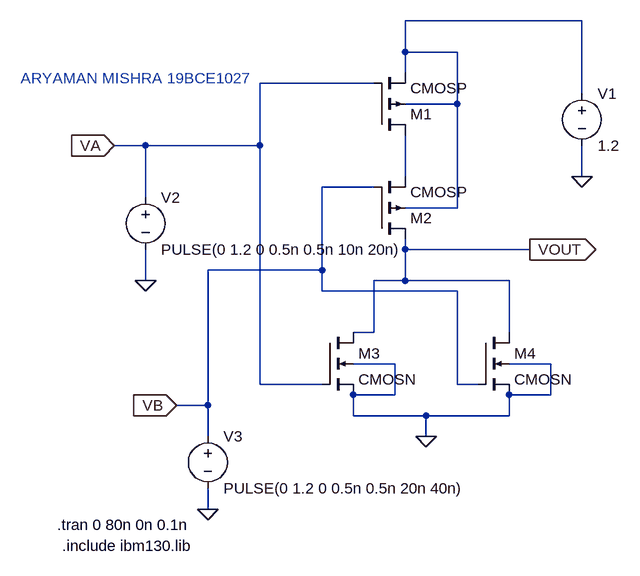
[diagram p0: schematic exp6_task6.asc]
exp6_task6.asc, the LTspice schematic file:
Version 4
SHEET 1 880 680
WIRE 544 -176 272 -176
WIRE 272 -128 272 -176
WIRE 352 -128 272 -128
WIRE 272 -96 272 -128
WIRE 224 -80 48 -80
WIRE 544 -64 544 -176
WIRE 352 -48 352 -128
WIRE 352 -48 272 -48
WIRE -128 16 -176 16
WIRE 48 16 48 -80
WIRE 48 16 -128 16
WIRE 272 64 272 0
WIRE 544 64 544 16
WIRE 224 80 144 80
WIRE -128 96 -128 16
WIRE 352 112 352 -48
WIRE 352 112 272 112
WIRE 272 176 272 160
WIRE 464 176 272 176
WIRE 144 208 144 80
WIRE 144 208 -32 208
WIRE -128 224 -128 176
WIRE 272 224 272 176
WIRE 272 224 224 224
WIRE 432 224 272 224
WIRE 144 240 144 208
WIRE 352 240 144 240
WIRE 224 304 224 224
WIRE 224 304 192 304
WIRE 432 304 432 224
WIRE 256 352 192 352
WIRE 496 352 432 352
WIRE 48 384 48 16
WIRE 144 384 48 384
WIRE 352 384 352 240
WIRE 384 384 352 384
WIRE 256 400 256 352
WIRE 256 400 192 400
WIRE 496 400 496 352
WIRE 496 400 432 400
WIRE -32 416 -32 208
WIRE -32 416 -80 416
WIRE 192 432 192 400
WIRE 304 432 192 432
WIRE 432 432 432 400
WIRE 432 432 304 432
WIRE -32 464 -32 416
WIRE 304 464 304 432
WIRE -32 576 -32 544
FLAG 544 64 0
FLAG -128 224 0
FLAG -32 576 0
FLAG -176 16 VA
IOPIN -176 16 In
FLAG -80 416 VB
IOPIN -80 416 In
FLAG 464 176 VOUT
IOPIN 464 176 Out
FLAG 304 464 0
SYMBOL voltage 544 -80 R0
WINDOW 123 0 0 Left 0
WINDOW 39 0 0 Left 0
SYMATTR InstName V1
SYMATTR Value 1.2
SYMBOL voltage -128 80 R0
WINDOW 123 0 0 Left 0
WINDOW 39 0 0 Left 0
SYMATTR InstName V2
SYMATTR Value PULSE(0 1.2 0 0.5n 0.5n 10n 20n)
SYMBOL voltage -32 448 R0
WINDOW 123 0 0 Left 0
WINDOW 39 0 0 Left 0
SYMATTR InstName V3
SYMATTR Value PULSE(0 1.2 0 0.5n 0.5n 20n 40n)
SYMBOL CMOSP 224 0 M180
SYMATTR InstName M1
SYMATTR Value2 l=130n w=200n
SYMBOL CMOSP 224 160 M180
SYMATTR InstName M2
SYMATTR Value2 l=130n w=200n
SYMBOL CMOSN 144 304 R0
SYMATTR InstName M3
SYMATTR Value2 l=130n w=200n
SYMBOL CMOSN 384 304 R0
SYMATTR InstName M4
SYMATTR Value2 l=130n w=200n
TEXT -264 600 Left 2 !.tran 0 80n 0n 0.1n
TEXT -256 632 Left 2 !.include ibm130.lib
TEXT -320 -88 Left 2 ;ARYAMAN MISHRA 19BCE1027

The netlist it stands for:
* exp6_task6.asc
V1 N001 0 1.2
V2 VA 0 PULSE(0 1.2 0 0.5n 0.5n 10n 20n)
V3 VB 0 PULSE(0 1.2 0 0.5n 0.5n 20n 40n)
M1 N002 VA N001 N001 CMOSP l=130n w=200n
M2 VOUT VB N002 N001 CMOSP l=130n w=200n
M3 VOUT VA 0 0 CMOSN l=130n w=200n
M4 VOUT VB 0 0 CMOSN l=130n w=200n
.model NMOS NMOS
.model PMOS PMOS
.lib standard.mos
.tran 0 80n 0n 0.1n
.include ibm130.lib
* ARYAMAN MISHRA 19BCE1027
.backanno
.end

* Results of the author's LTspice run, read from the files saved beside the schematic
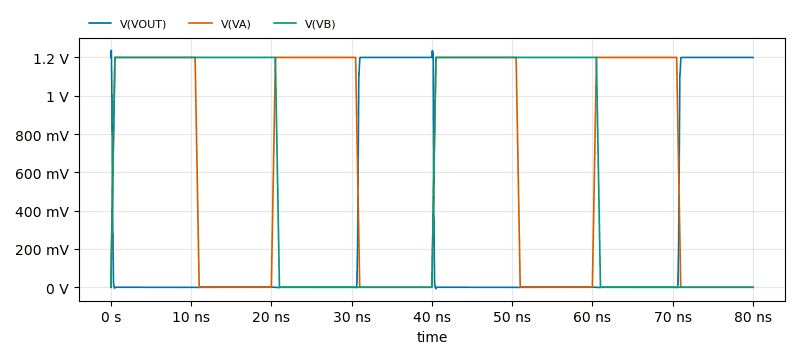
[diagram p1: Transient Analysis of exp6_task6.asc, plotted from the saved traces]
* Transient Analysis, 1 run:
*   V(VOUT): min -8.134 mV, max 1.237 V, average 282.3 mV, rms 580.1 mV, last 1.2 V
*   V(VA): min 0 V, max 1.2 V, average 630 mV, rms 862.8 mV, last 0 V
*   V(VB): min 0 V, max 1.2 V, average 615 mV, rms 855.7 mV, last 0 V